# Altium project ELRS-RX-MODULE-V11-20260127.PrjPcb
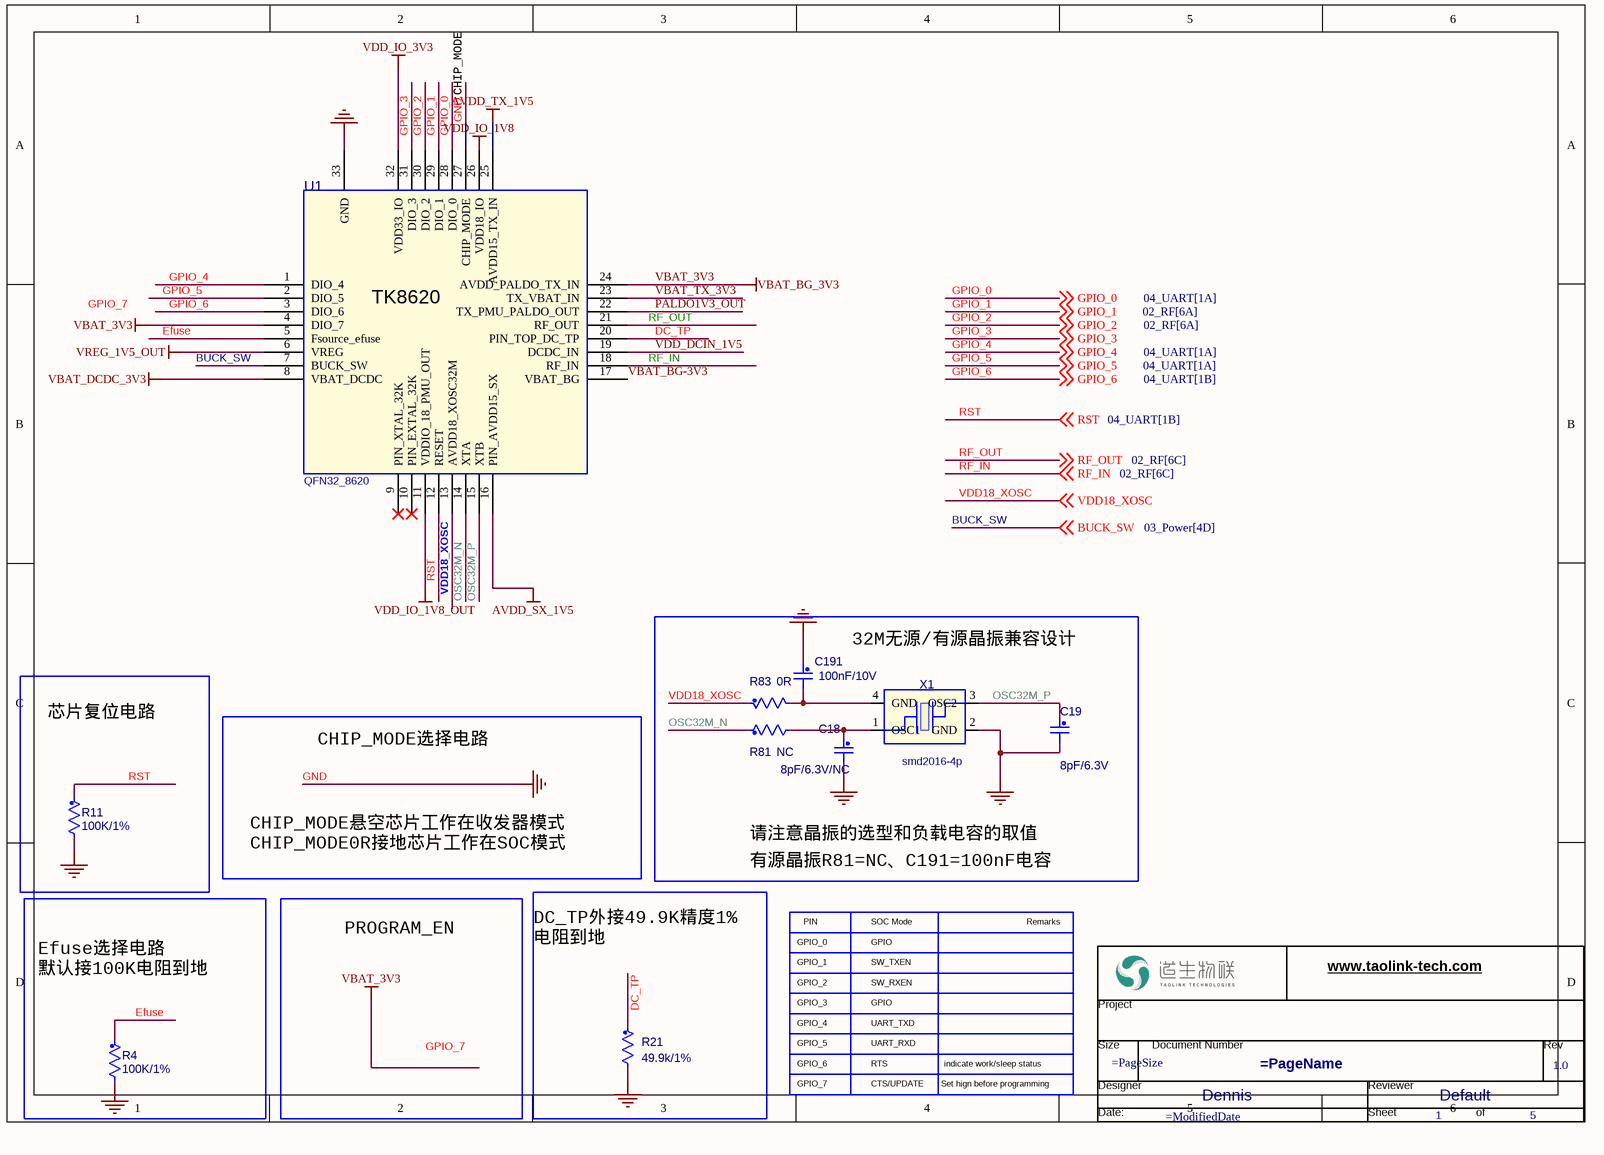
[diagram p0: 01_SOC.SchDoc]
5 sheets, 80 parts. Net scope: global (net labels, ports and power ports of the same name join across sheets).
Board file: ELRS-RX-MODULE-V11-20260204.PcbDoc
Sheets:
  01_SOC.SchDoc
  02_RF.SchDoc
  03_Power.SchDoc
  04_UART.SchDoc
  05_Notes.SchDoc

## Sheet 01_SOC.SchDoc
size 297 x 209 mm; SheetNumber: 1; SheetTotal: 5; Page Create Date: March  8, 1995; Page Number: 1; Page Size: A4; Reviewer: Default; Page Count: 5; Designer: Dennis; Page Name: 01_SOC; RevCode: 1.0; DsnPath: H:\PCB\2026\狼王傻波一\20260204_V0_ELRS-RX\ELRS-RX-MODULE-V11\ELRS-RX-MODULE-V11-20260127.DSN; SchematicName: SCHEMATIC1; PageName: 01_SOC; PageSize: A4; TopSchematic: True

### Parts
(Parts that share a designator on the sheet are numbered #1, #2 ... from top to bottom, then left to right.)
*#1  RevCode: 1.0  Designer: Dennis  Reviewer: Default  Page Number: 1  Page Count: 5  (graphical)
C18  8pF/6.3V/NC  [0201]
C19  8pF/6.3V  [0201]
C191  100nF/10V  [0201]
R4  100K/1%  [0201]
R11  100K/1%  [0201]
R21  49.9k/1%  [0201]
R81  NC  [0201]
R83  0R  [0201]
U1  TK8620  [QFN32_8620]
X1  X1E0002510059  [smd2016-4p]  (value not drawn)

### Blocks framed on the sheet
芯片复位电路: R11

### Nets
AVDD_SX_1V5: U1.16(PIN_AVDD15_SX)
AVDD_TX_1V5: U1.25(AVDD15_TX_IN)
GND: C18.2 C19.2 C191.1 R4.2 R11.2 R21.2 U1.27(CHIP_MODE) U1.33(GND) X1.2(GND)
PALDO1V3_OUT: U1.22(TX_PMU_PALDO_OUT)
VBAT_3V3: U1.4(DIO_7) U1.8(VBAT_DCDC) U1.23(TX_VBAT_IN) U1.24(AVDD_PALDO_TX_IN) U1.32(VDD33_IO)  [also labelled VBAT_BG_3V3, VBAT_DCDC_3V3, VBAT_TX_3V3, VDD_IO_3V3]
VBAT_BG-3V3: U1.17(VBAT_BG)
VDD_DCIN_1V5: U1.19(DCDC_IN)
VDD_IO_1V8: U1.11(VDDIO_18_PMU_OUT) U1.26(VDD18_IO)  [also labelled VDD_IO_1V8_OUT]
VREG_1V5_OUT: U1.6(VREG)
BUCK_SW: U1.7(BUCK_SW) ; off-sheet BUCK_SW
DC_TP: R21.1 U1.20(PIN_TOP_DC_TP)
Efuse: R4.1 U1.5(Fsource_efuse)
GPIO_0: U1.28(DIO_0) ; off-sheet GPIO_0
GPIO_1: U1.29(DIO_1) ; off-sheet GPIO_1
GPIO_2: U1.30(DIO_2) ; off-sheet GPIO_2
GPIO_3: U1.31(DIO_3) ; off-sheet GPIO_3
GPIO_4: U1.1(DIO_4) ; off-sheet GPIO_4
GPIO_5: U1.2(DIO_5) ; off-sheet GPIO_5
GPIO_6: U1.3(DIO_6) ; off-sheet GPIO_6
OSC32M_N: R81.1 U1.14(XTA)
OSC32M_P: C19.1 U1.15(XTB) X1.3(OSC2)
RF_IN: U1.18(RF_IN) ; off-sheet RF_IN
RF_OUT: U1.21(RF_OUT) ; off-sheet RF_OUT
RST: R11.1 U1.12(RESET) ; off-sheet RST
VDD18_XOSC: R83.1 U1.13(AVDD18_XOSC32M) ; off-sheet VDD18_XOSC
NetC18_1: C18.1 R81.2 X1.1(OSC1)
NetC191_2: C191.2 R83.2 X1.4(GND)

Not connected (* = marked no-connect by the designer): U1 9(PIN_XTAL_32K)* 10(PIN_EXTAL_32K)*

### Notes on the sheet
- CHIP_MODE
- 32M无源/有源晶振兼容设计
- CHIP_MODE选择电路
- CHIP_MODE悬空芯片工作在收发器模式
  CHIP_MODE0R接地芯片工作在SOC模式
- 请注意晶振的选型和负载电容的取值
- 有源晶振R81=NC、C191=100nF电容
- PROGRAM_EN
- DC_TP外接49.9K精度1%
  电阻到地
- GPIO_0
- PIN
- SOC Mode
- GPIO
- (near *#1) Remarks
- Efuse选择电路
  默认接100K电阻到地
- GPIO_1
- GPIO_2
- GPIO_3
- SW_RXEN
- SW_TXEN
- GPIO_4
- GPIO_5
- GPIO_6
- RTS
- UART_TXD
- UART_RXD
- indicate work/sleep status
- GPIO_7
- CTS/UPDATE
- Set hign before programming
- Labels drawn without touching a wire or pin: GPIO_7
- (in symbol TaoLin_DesignName) www.taolink-tech.com; Project; Size; Document Number; Rev; Designer; Reviewer; Date:; Sheet; of

### Library data of the parts
*#1 = TaoLin_DesignName: Page Create Date: March  8, 1995; Page Size: =PageSize; Page Name: =PageName; Page Modify Date: =ModifiedDate
C18 = Ceramic Capacitor: Ceramic Capacitor,22uF,6.3V,+/-20%,X5R,0603,Samsung; Part Reference: C18; Manufacturer P/N: CL10A226MQ8NRNC; Myir P/N: 20401.00086; Value: 8pF/6.3V/NC; PCB Footprint: 0201; Datasheet: Samsung.pdf; Reserve Value: 22uF; Manufacturer: Samsung; Part Type: Ceramic Capacitor
C19 = Ceramic Capacitor: Ceramic Capacitor,22uF,6.3V,+/-20%,X5R,0603,Samsung; Part Reference: C19; Manufacturer P/N: CL10A226MQ8NRNC; Myir P/N: 20401.00086; Value: 8pF/6.3V; PCB Footprint: 0201; Part Type: Ceramic Capacitor; Manufacturer: Samsung; Reserve Value: 22uF; Datasheet: Samsung.pdf
C191 = Ceramic Capacitor: Ceramic Capacitor,22uF,6.3V,+/-20%,X5R,0603,Samsung; Part Reference: C191; Manufacturer P/N: CL10A226MQ8NRNC; Myir P/N: 20401.00086; Value: 100nF/10V; PCB Footprint: 0201; Datasheet: Samsung.pdf; Reserve Value: 22uF; Manufacturer: Samsung; Part Type: Ceramic Capacitor
R4 = Resister: Thick Film Resistor,0R,+/-5%,1/16W,-55°C ~ 155°C,SMD,0402,Fenghua; Part Reference: R4; Manufacturer P/N: RC-02000JT; Myir P/N: 20301.00186; Value: 100K/1%; PCB Footprint: 0201; Datasheet: FH规格书_2018-07-30.pdf; Reserve Value: 0R; Manufacturer: Fenghua; Part Type: Thick Film Resistor
R11 = Resister: Thick Film Resistor,0R,+/-5%,1/16W,-55°C ~ 155°C,SMD,0402,Fenghua; Part Reference: R11; Manufacturer P/N: RC-02000JT; Myir P/N: 20301.00186; Value: 100K/1%; PCB Footprint: 0201; Datasheet: FH规格书_2018-07-30.pdf; Reserve Value: 0R; Manufacturer: Fenghua; Part Type: Thick Film Resistor
R21 = Resister: Thick Film Resistor,0R,+/-5%,1/16W,-55°C ~ 155°C,SMD,0402,Fenghua; Part Reference: R21; Manufacturer P/N: RC-02000JT; Myir P/N: 20301.00186; Value: 49.9k/1%; PCB Footprint: 0201; Part Type: Thick Film Resistor; Manufacturer: Fenghua; Reserve Value: 0R; Datasheet: FH规格书_2018-07-30.pdf
R81 = Resister: Thick Film Resistor,0R,+/-5%,1/16W,-55°C ~ 155°C,SMD,0402,Fenghua; Part Reference: R81; Manufacturer P/N: RC-02000JT; Myir P/N: 20301.00186; Value: NC; PCB Footprint: 0201; Part Type: Thick Film Resistor; Manufacturer: Fenghua; Reserve Value: 0R; Datasheet: FH规格书_2018-07-30.pdf
R83 = Resister: Thick Film Resistor,0R,+/-5%,1/16W,-55°C ~ 155°C,SMD,0402,Fenghua; Part Reference: R83; Manufacturer P/N: RC-02000JT; Myir P/N: 20301.00186; Value: 0R; PCB Footprint: 0201; Part Type: Thick Film Resistor; Manufacturer: Fenghua; Reserve Value: 0R; Datasheet: FH规格书_2018-07-30.pdf
U1 = K2201A_3: Part Reference: U1; Value: TK8620; PCB Footprint: QFN32_8620
X1 = Crystal_32M: Part Reference: X1; Value: X1E0002510059; PCB Footprint: smd2016-4p

## Sheet 02_RF.SchDoc
size 297 x 209 mm; Page Create Date: March  8, 1995; Page Number: 2; Page Size: A4; Reviewer: Default; Page Count: 5; Designer: Dennis; Page Name: 02_RF; RevCode: 1.0; DsnPath: H:\PCB\2026\狼王傻波一\20260204_V0_ELRS-RX\ELRS-RX-MODULE-V11\ELRS-RX-MODULE-V11-20260127.DSN; SchematicName: SCHEMATIC1; PageName: 02_RF; PageSize: A4; TopSchematic: True
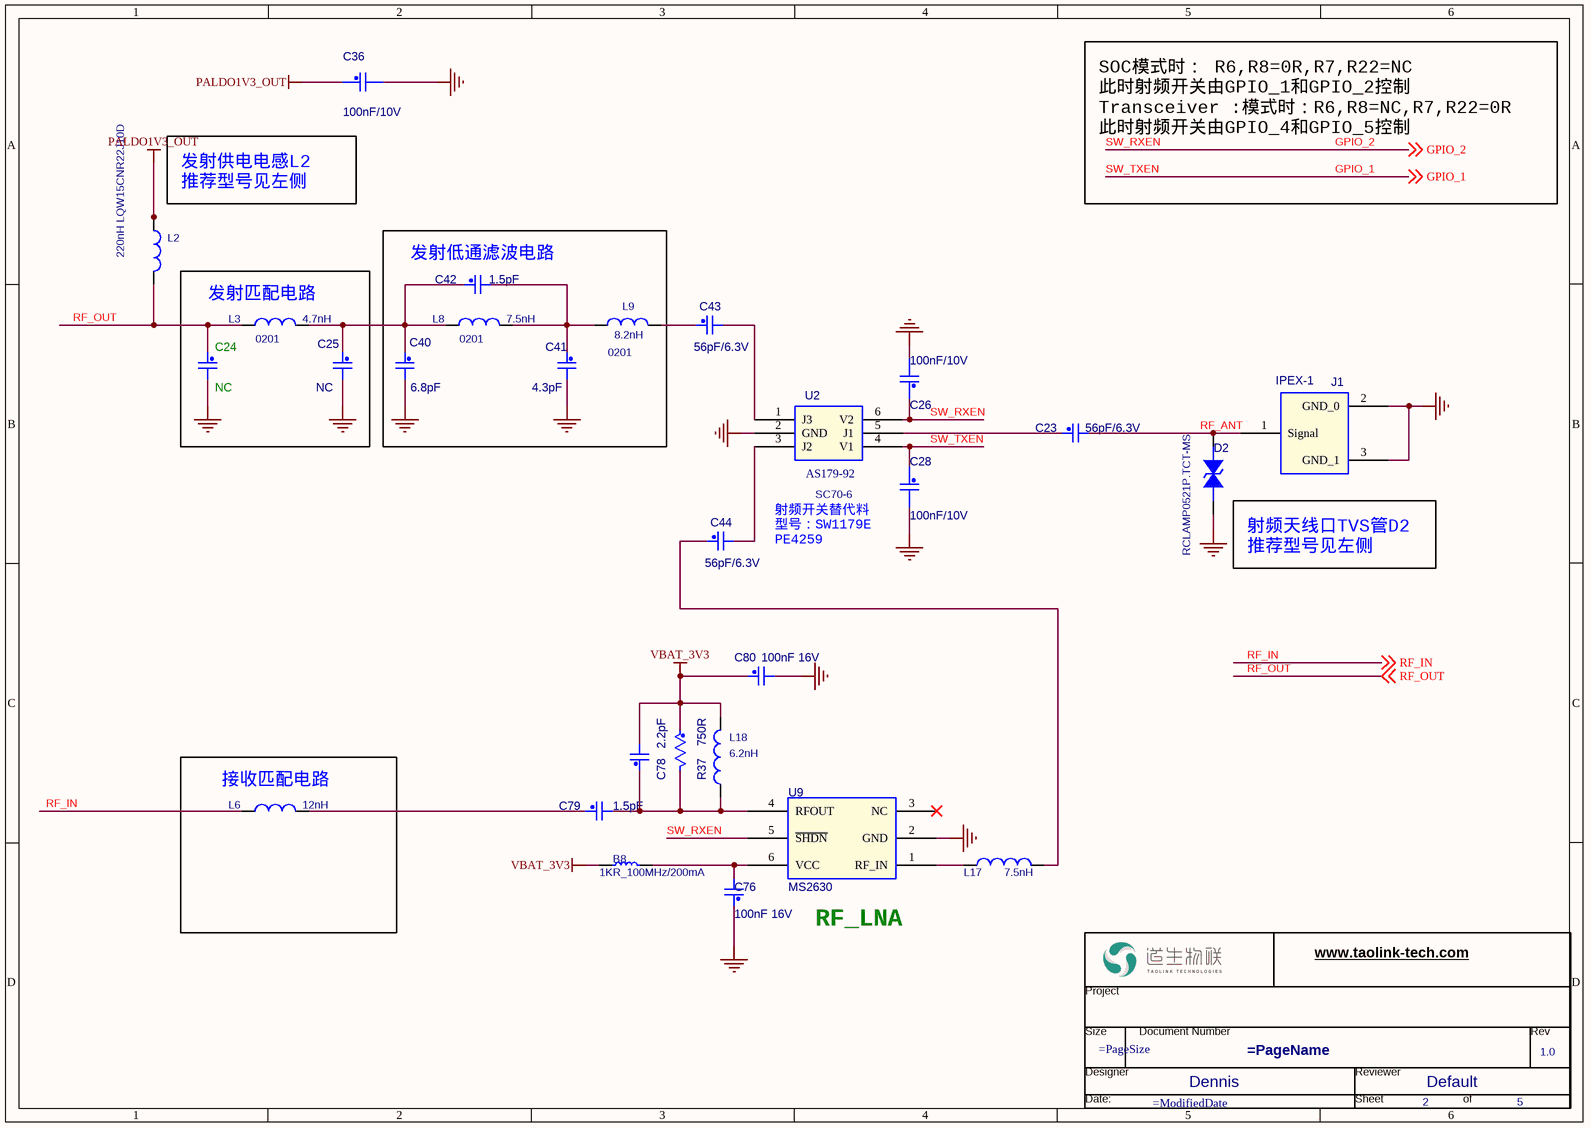
[diagram p1: 02_RF.SchDoc]

### Parts
(Parts that share a designator on the sheet are numbered #1, #2 ... from top to bottom, then left to right.)
*#2  RevCode: 1.0  Designer: Dennis  Reviewer: Default  Page Number: 2  Page Count: 5  (graphical)
B8  1KR_100MHz/200mA  [0201]
C23  56pF/6.3V  [0201]
C24  NC  [0201]
C25  NC  [0201]
C26  100nF/10V  [0201]
C28  100nF/10V  [0201]
C36  100nF/10V  [0201]
C40  6.8pF  [0201]
C41  4.3pF  [0201]
C42  1.5pF  [0201]
C43  56pF/6.3V  [0201]
C44  56pF/6.3V  [0201]
C76  100nF 16V  [0201]
C78  2.2pF  [0201]
C79  1.5pF  [0201]
C80  100nF 16V  [0201]
D2  RCLAMP0521P.TCT-MS  [TVS-0402]
J1  IPEX-1  [IPEX-1]
L2  220nH LQW15CNR22J10D  [L0402]
L3  4.7nH  [0201]
L6  12nH  [0201]
L8  7.5nH  [0201]
L9  8.2nH  [0201]
L17  7.5nH  [0201]
L18  6.2nH  [0201]
R37  750R  [0201]
U2  AS179-92  [SC70-6]
U9  MS2630  [SOT23-6]

### Blocks framed on the sheet
发射匹配电路: C24 C25 L3
发射低通滤波电路: C40-C42 L8 L9
接收匹配电路: L6

### Nets
GND: C24.2 C25.2 C26.2 C28.2 C36.2 C40.2 C41.2 C76.1 C80.2 D2.2(CATHODE) J1.2(GND_0) J1.3(GND_1) U2.2(GND) U9.2(GND)
PALDO1V3_OUT: C36.1 L2.1
VBAT_3V3: B8.2 C78.2 C80.1 L18.2 R37.1
GPIO_1: C28.1 U2.4(V1) ; off-sheet GPIO_1  [also labelled SW_TXEN]
GPIO_2: C26.1 U2.6(V2) U9.5(~{SHDN}) ; off-sheet GPIO_2  [also labelled SW_RXEN]
RF_ANT: C23.2 D2.1(ANODE) J1.1(Signal)
RF_IN: L6.1 ; off-sheet RF_IN
RF_OUT: C24.1 L2.2 L3.1 ; off-sheet RF_OUT
NetB8_1: B8.1 C76.2 U9.6(VCC)
NetC23_1: C23.1 U2.5(J1)
NetC25_1: C25.1 C40.1 C42.1 L3.2 L8.1
NetC41_1: C41.1 C42.2 L8.2 L9.1
NetC43_1: C43.1 L9.2
NetC43_2: C43.2 U2.1(J3)
NetC44_1: C44.1 L17.2
NetC44_2: C44.2 U2.3(J2)
NetC78_1: C78.1 C79.2 L18.1 R37.2 U9.4(RFOUT)
NetC79_1: C79.1 L6.2
NetL17_1: L17.1 U9.1(RF_IN)

Not connected (* = marked no-connect by the designer): U9 3(NC)*

### Notes on the sheet
- SOC模式时： R6,R8=0R,R7,R22=NC
  此时射频开关由GPIO_1和GPIO_2控制
  Transceiver :模式时：R6,R8=NC,R7,R22=0R
  此时射频开关由GPIO_4和GPIO_5控制
- 发射供电电感L2
  推荐型号见左侧
- (near C28) 射频开关替代料
  型号：SW1179E
  PE4259
- 射频天线口TVS管D2
  推荐型号见左侧
- (near U9) RF_LNA
- (in symbol TaoLin_DesignName) www.taolink-tech.com; Project; Size; Document Number; Rev; Designer; Reviewer; Date:; Sheet; of

### Library data of the parts
*#2 = TaoLin_DesignName: Page Create Date: March  8, 1995; Page Size: =PageSize; Page Name: =PageName; Page Modify Date: =ModifiedDate
B8 = INDUCTOR_Dup1: Part Reference: B8; Reviewed2: LBY; FPLIST: 0402R_S,0402R,0402R_M,0402R_MIN,R0402; 存货简称: TURBO; 型号: 1.5K 1%; 规格: 贴装碳膜电阻器－1.5KR－±1%－1/16W－0402; 存货名称: 贴片电阻; 存货编码: 040101070; Value: 1KR_100MHz/200mA; PCB Footprint: 0201
C23 = Ceramic Capacitor: Ceramic Capacitor,22uF,6.3V,+/-20%,X5R,0603,Samsung; Part Reference: C23; Manufacturer P/N: CL10A226MQ8NRNC; Myir P/N: 20401.00086; Value: 56pF/6.3V; PCB Footprint: 0201; Part Type: Ceramic Capacitor; Manufacturer: Samsung; Reserve Value: 22uF; Datasheet: Samsung.pdf
C24 = Ceramic Capacitor: Ceramic Capacitor,22uF,6.3V,+/-20%,X5R,0603,Samsung; Part Reference: C24; Manufacturer P/N: CL10A226MQ8NRNC; Myir P/N: 20401.00086; Value: NC; PCB Footprint: 0201; Part Type: Ceramic Capacitor; Manufacturer: Samsung; Reserve Value: 22uF; Datasheet: Samsung.pdf
C25 = Ceramic Capacitor: Ceramic Capacitor,22uF,6.3V,+/-20%,X5R,0603,Samsung; Part Reference: C25; Manufacturer P/N: CL10A226MQ8NRNC; Myir P/N: 20401.00086; Value: NC; PCB Footprint: 0201; Part Type: Ceramic Capacitor; Manufacturer: Samsung; Reserve Value: 22uF; Datasheet: Samsung.pdf
C26 = Ceramic Capacitor_14: Ceramic Capacitor,100nF,50V,+/-10%,X7R,0402,Fenghua; Part Reference: C26; Manufacturer P/N: 0402B104K500NT; Myir P/N: 2040180111; Value: 100nF/10V; PCB Footprint: 0201; Part Type: Ceramic Capacitor; Manufacturer: Fenghua; Reserve Value: 100nF; Datasheet: 附件7 风华片容全系列承认书.pdf
C28 = Ceramic Capacitor_14: Ceramic Capacitor,100nF,50V,+/-10%,X7R,0402,Fenghua; Part Reference: C28; Manufacturer P/N: 0402B104K500NT; Myir P/N: 2040180111; Value: 100nF/10V; PCB Footprint: 0201; Datasheet: 附件7 风华片容全系列承认书.pdf; Reserve Value: 100nF; Manufacturer: Fenghua; Part Type: Ceramic Capacitor
C36 = Ceramic Capacitor_14: Ceramic Capacitor,100nF,50V,+/-10%,X7R,0402,Fenghua; Part Reference: C36; Manufacturer P/N: 0402B104K500NT; Myir P/N: 2040180111; Value: 100nF/10V; PCB Footprint: 0201; Part Type: Ceramic Capacitor; Manufacturer: Fenghua; Reserve Value: 100nF; Datasheet: 附件7 风华片容全系列承认书.pdf
C40 = Ceramic Capacitor: Ceramic Capacitor,22uF,6.3V,+/-20%,X5R,0603,Samsung; Part Reference: C40; Manufacturer P/N: CL10A226MQ8NRNC; Myir P/N: 20401.00086; Value: 6.8pF; PCB Footprint: 0201; Datasheet: Samsung.pdf; Reserve Value: 22uF; Manufacturer: Samsung; Part Type: Ceramic Capacitor
C41 = Ceramic Capacitor: Ceramic Capacitor,22uF,6.3V,+/-20%,X5R,0603,Samsung; Part Reference: C41; Manufacturer P/N: CL10A226MQ8NRNC; Myir P/N: 20401.00086; Value: 4.3pF; PCB Footprint: 0201; Datasheet: Samsung.pdf; Reserve Value: 22uF; Manufacturer: Samsung; Part Type: Ceramic Capacitor
C42 = Ceramic Capacitor: Ceramic Capacitor,22uF,6.3V,+/-20%,X5R,0603,Samsung; Part Reference: C42; Manufacturer P/N: CL10A226MQ8NRNC; Myir P/N: 20401.00086; Value: 1.5pF; PCB Footprint: 0201; Part Type: Ceramic Capacitor; Manufacturer: Samsung; Reserve Value: 22uF; Datasheet: Samsung.pdf
C43 = Ceramic Capacitor: Ceramic Capacitor,22uF,6.3V,+/-20%,X5R,0603,Samsung; Part Reference: C43; Manufacturer P/N: CL10A226MQ8NRNC; Myir P/N: 20401.00086; Value: 56pF/6.3V; PCB Footprint: 0201; Datasheet: Samsung.pdf; Reserve Value: 22uF; Manufacturer: Samsung; Part Type: Ceramic Capacitor
C44 = Ceramic Capacitor: Ceramic Capacitor,22uF,6.3V,+/-20%,X5R,0603,Samsung; Part Reference: C44; Manufacturer P/N: CL10A226MQ8NRNC; Myir P/N: 20401.00086; Value: 56pF/6.3V; PCB Footprint: 0201; Part Type: Ceramic Capacitor; Manufacturer: Samsung; Reserve Value: 22uF; Datasheet: Samsung.pdf
C76 = Ceramic Capacitor: Ceramic Capacitor,22uF,6.3V,+/-20%,X5R,0603,Samsung; Part Reference: C76; Manufacturer P/N: CL10A226MQ8NRNC; Myir P/N: 20401.00086; Value: 100nF 16V; Datasheet: Samsung.pdf; Reserve Value: 22uF; Manufacturer: Samsung; Part Type: Ceramic Capacitor; PCB Footprint: 0201
C78 = Ceramic Capacitor: Ceramic Capacitor,22uF,6.3V,+/-20%,X5R,0603,Samsung; Part Reference: C78; Manufacturer P/N: CL10A226MQ8NRNC; Myir P/N: 20401.00086; Value: 2.2pF; PCB Footprint: 0201; Part Type: Ceramic Capacitor; Manufacturer: Samsung; Reserve Value: 22uF; Datasheet: Samsung.pdf
C79 = Ceramic Capacitor: Ceramic Capacitor,22uF,6.3V,+/-20%,X5R,0603,Samsung; Part Reference: C79; Manufacturer P/N: CL10A226MQ8NRNC; Myir P/N: 20401.00086; Value: 1.5pF; PCB Footprint: 0201; Part Type: Ceramic Capacitor; Manufacturer: Samsung; Reserve Value: 22uF; Datasheet: Samsung.pdf
C80 = Ceramic Capacitor: Ceramic Capacitor,22uF,6.3V,+/-20%,X5R,0603,Samsung; Part Reference: C80; Manufacturer P/N: CL10A226MQ8NRNC; Myir P/N: 20401.00086; Value: 100nF 16V; PCB Footprint: 0201; Datasheet: Samsung.pdf; Reserve Value: 22uF; Manufacturer: Samsung; Part Type: Ceramic Capacitor
D2 = TVS: Part Reference: D2; Value: RCLAMP0521P.TCT-MS; PCB Footprint: TVS-0402
J1 = IPEX-1: Part Reference: J1; Value: IPEX-1; PCB Footprint: IPEX-1
L2 = INDUCTOR_Dup2: Part Reference: L2; Value: 220nH LQW15CNR22J10D; PCB Footprint: L0402
L3 = INDUCTOR_Dup2: Part Reference: L3; Value: 4.7nH; PCB Footprint: 0201
L6 = INDUCTOR_Dup2: Part Reference: L6; Value: 12nH; PCB Footprint: 0201
L8 = INDUCTOR_Dup2: Part Reference: L8; Value: 7.5nH; PCB Footprint: 0201
L9 = INDUCTOR_Dup2: Part Reference: L9; Value: 8.2nH; PCB Footprint: 0201
L17 = INDUCTOR: Part Reference: L17; Value: 7.5nH; PCB Footprint: 0201
L18 = INDUCTOR: Part Reference: L18; Value: 6.2nH; PCB Footprint: 0201
R37 = Resister: Thick Film Resistor,0R,+/-5%,1/16W,-55°C ~ 155°C,SMD,0402,Fenghua; Part Reference: R37; Manufacturer P/N: RC-02000JT; Myir P/N: 20301.00186; Value: 750R; PCB Footprint: 0201; Part Type: Thick Film Resistor; Manufacturer: Fenghua; Reserve Value: 0R; Datasheet: FH规格书_2018-07-30.pdf
U2 = AS179-92: Part Reference: U2; Value: AS179-92; PCB Footprint: SC70-6
U9 = MS2630: Part Reference: U9; Value: MS2630; PCB Footprint: SOT23-6

## Sheet 03_Power.SchDoc
size 297 x 209 mm; SheetNumber: 3; SheetTotal: 5; Page Create Date: March  8, 1995; Page Number: 3; Page Size: A4; Reviewer: Default; Page Count: 5; Designer: Dennis; Page Name: 03_Power; RevCode: 1.0; DsnPath: H:\PCB\2026\狼王傻波一\20260204_V0_ELRS-RX\ELRS-RX-MODULE-V11\ELRS-RX-MODULE-V11-20260127.DSN; SchematicName: SCHEMATIC1; PageName: 03_Power; PageSize: A4; TopSchematic: True
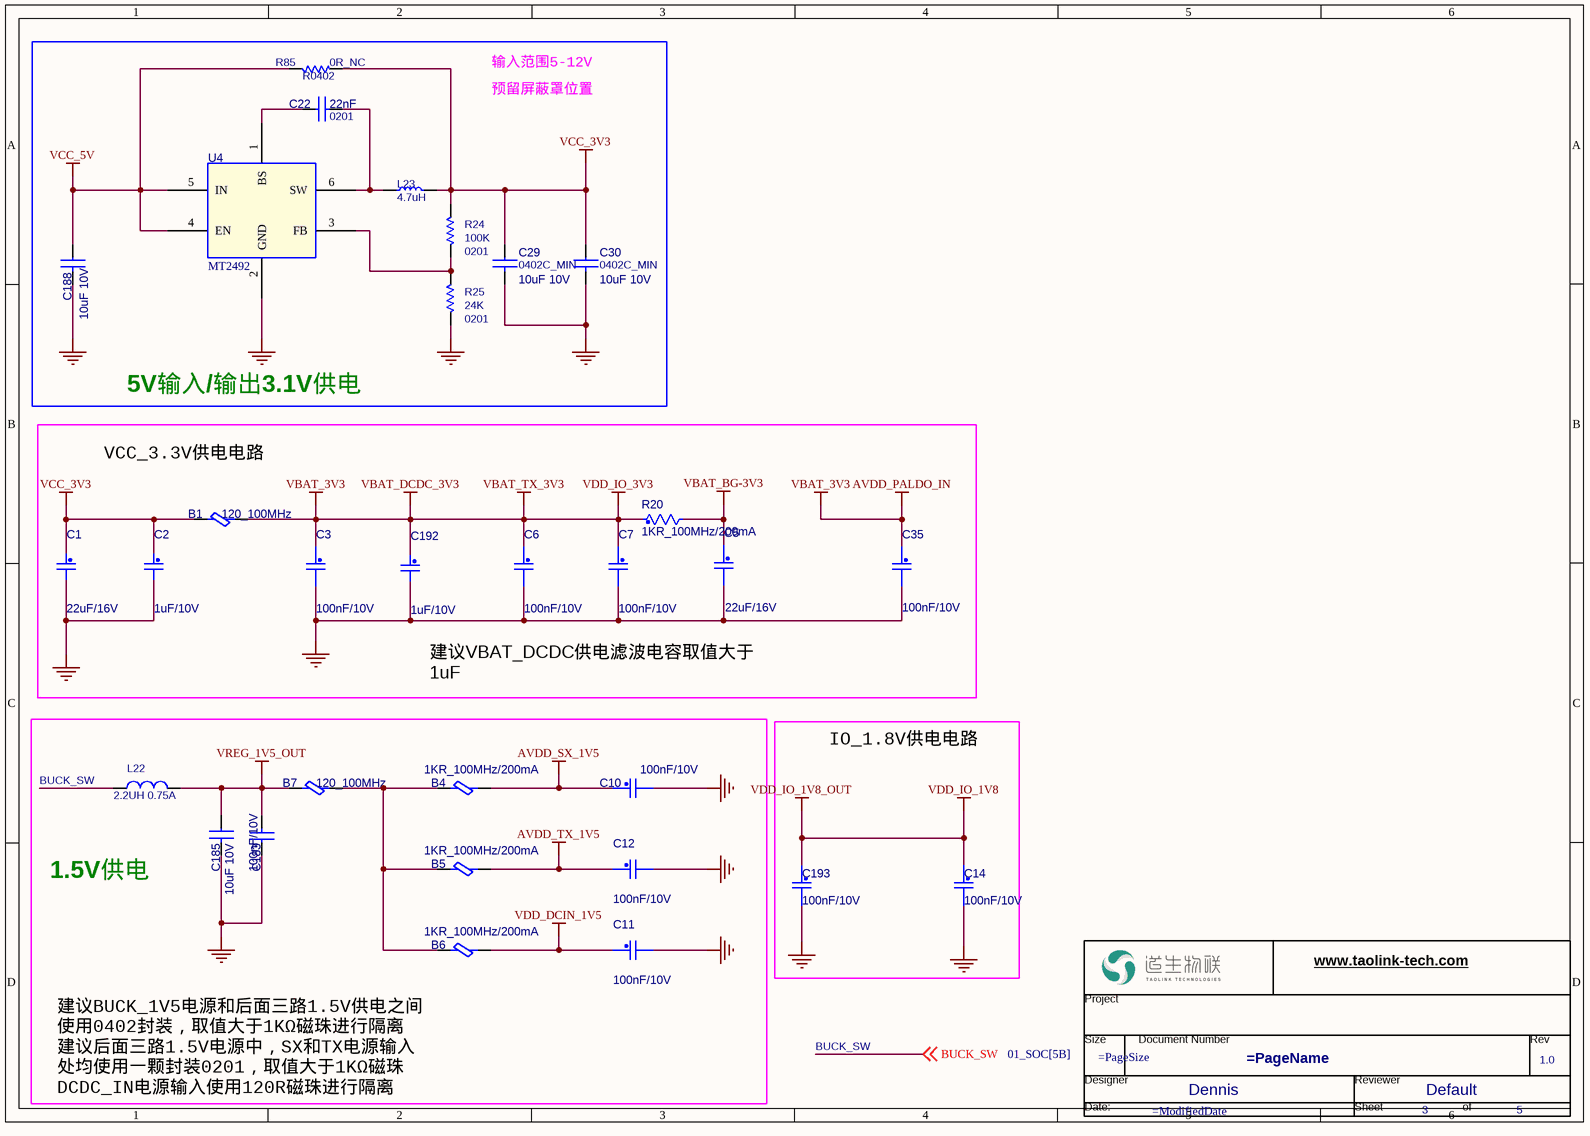
[diagram p2: 03_Power.SchDoc]

### Parts
(Parts that share a designator on the sheet are numbered #1, #2 ... from top to bottom, then left to right.)
*#3  RevCode: 1.0  Designer: Dennis  Reviewer: Default  Page Number: 3  Page Count: 5  (graphical)
B1  120_100MHz  [l0402]
B4  1KR_100MHz/200mA  [0201]
B5  1KR_100MHz/200mA  [0201]
B6  1KR_100MHz/200mA  [0201]
B7  120_100MHz  [l0402]
C1  22uF/16V  [C0402]
C2  1uF/10V  [0201]
C3  100nF/10V  [0201]
C5  22uF/16V  [C0402]
C6  100nF/10V  [0201]
C7  100nF/10V  [0201]
C10  100nF/10V  [0201]
C11  100nF/10V  [0201]
C12  100nF/10V  [0201]
C14  100nF/10V  [0201]
C22  22nF  [0201]
C29  10uF 10V  [0402C_MIN]
C30  10uF 10V  [0402C_MIN]
C35  100nF/10V  [0201]
C183  100nF/10V  [0201]
C185  10uF 10V  [0402C_MIN]
C188  10uF 10V  [0402C_MIN]
C192  1uF/10V  [0201]
C193  100nF/10V  [0201]
L22  2.2UH 0.75A  [C0603]
L23  4.7uH  [R0603]
R20  1KR_100MHz/200mA  [0201]
R24  100K  [0201]
R25  24K  [0201]
R85  0R_NC  [R0402]
U4  MT2492  [SOT23-6]

### Blocks framed on the sheet
5V输入/输出3.1V供电: C22 C29 C30 C188 L23 R24 R25 R85 U4
VCC_3.3V供电电路: B1 C1-C3 C5-C7 C35 C192 R20
1.5V供电: B4-B7 C10-C12 C183 C185 L22
IO_1.8V供电电路: C14 C193

### Nets
AVDD_SX_1V5: B4.2 C10.1
AVDD_TX_1V5: B5.2 C12.1
GND: C1.2 C2.2 C3.2 C5.2 C6.2 C7.2 C10.2 C11.2 C12.2 C14.2 C29.2 C30.2 C35.2 C183.1 C185.2 C188.2 C192.2 C193.2 R25.2 U4.2(GND)
VBAT_3V3: B1.2 C3.1 C6.1 C7.1 C35.1 C192.1 R20.1  [also labelled AVDD_PALDO_IN, VBAT_DCDC_3V3, VBAT_TX_3V3, VDD_IO_3V3]
VBAT_BG-3V3: C5.1 R20.2
VCC_3V3: B1.1 C1.1 C2.1 C29.1 C30.1 L23.2 R24.1 R85.2
VCC_5V: C188.1 R85.1 U4.4(EN) U4.5(IN)
VDD_DCIN_1V5: B6.2 C11.1
VDD_IO_1V8: C14.1 C193.1  [also labelled VDD_IO_1V8_OUT]
VREG_1V5_OUT: B7.1 C183.2 C185.1 L22.2
BUCK_SW: L22.1 ; off-sheet BUCK_SW
NetB4_1: B4.1 B5.1 B6.1 B7.2
NetC22_1: C22.1 U4.1(BS)
NetC22_2: C22.2 L23.1 U4.6(SW)
NetR24_2: R24.2 R25.1 U4.3(FB)

### Notes on the sheet
- 输入范围5-12V
- 预留屏蔽罩位置
- 建议VBAT_DCDC供电滤波电容取值大于1uF
  建议VBAT_BG供电滤波电容取值大于10uF
- (near B6) 建议BUCK_1V5电源和后面三路1.5V供电之间
  使用0402封装，取值大于1KΩ磁珠进行隔离
  建议后面三路1.5V电源中，SX和TX电源输入
  处均使用一颗封装0201，取值大于1KΩ磁珠
  DCDC_IN电源输入使用120R磁珠进行隔离
- (in symbol TaoLin_DesignName) www.taolink-tech.com; Project; Size; Document Number; Rev; Designer; Reviewer; Date:; Sheet; of

### Library data of the parts
*#3 = TaoLin_DesignName: Page Create Date: March  8, 1995; Page Size: =PageSize; Page Name: =PageName; Page Modify Date: =ModifiedDate
B1 = 1212_BEAD_0: FERRITE CHIP 120 OHM 500MA 0402; Part Reference: B1; eI Part#: 04_00075_01; Vendor Part#: 490-1005-1-ND; Mfg Part#: BLM15AG121SN1D; CLASS: DISCRETE; Mfg: Murata; Vendor: DigiKey; Oper. Temp. Range: -55C to 85C; Tolerance: 25%; ProcessType: SMT; Value: 120_100MHz; PCB Footprint: l0402; RoHS: Yes; Package: L0201; Manufacture Part Number: BLM15AG121SN1D
B4 = 1212_BEAD_0: FERRITE CHIP 120 OHM 500MA 0402; Part Reference: B4; Manufacture Part Number: BLM15AG121SN1D; Vendor Part#: 490-1005-1-ND; eI Part#: 04_00075_01; CLASS: DISCRETE; ProcessType: SMT; Tolerance: 25%; Oper. Temp. Range: -55C to 85C; Vendor: DigiKey; Mfg: Murata; Value: 1KR_100MHz/200mA; PCB Footprint: 0201; Package: 0402; Mfg Part#: BLM15AG121SN1D; RoHS: Yes
B5 = 1212_BEAD_0: FERRITE CHIP 120 OHM 500MA 0402; Part Reference: B5; Manufacture Part Number: BLM15AG121SN1D; Vendor Part#: 490-1005-1-ND; eI Part#: 04_00075_01; CLASS: DISCRETE; ProcessType: SMT; Tolerance: 25%; Oper. Temp. Range: -55C to 85C; Vendor: DigiKey; Mfg: Murata; Value: 1KR_100MHz/200mA; PCB Footprint: 0201; Package: 0402; Mfg Part#: BLM15AG121SN1D; RoHS: Yes
B6 = 1212_BEAD_0: FERRITE CHIP 120 OHM 500MA 0402; Part Reference: B6; Manufacture Part Number: BLM15AG121SN1D; Vendor Part#: 490-1005-1-ND; eI Part#: 04_00075_01; CLASS: DISCRETE; ProcessType: SMT; Tolerance: 25%; Oper. Temp. Range: -55C to 85C; Vendor: DigiKey; Mfg: Murata; Value: 1KR_100MHz/200mA; PCB Footprint: 0201; Package: 0402; Mfg Part#: BLM15AG121SN1D; RoHS: Yes
B7 = 1212_BEAD_0: FERRITE CHIP 120 OHM 500MA 0402; Part Reference: B7; Manufacture Part Number: BLM15AG121SN1D; Vendor Part#: 490-1005-1-ND; eI Part#: 04_00075_01; CLASS: DISCRETE; ProcessType: SMT; Tolerance: 25%; Oper. Temp. Range: -55C to 85C; Vendor: DigiKey; Mfg: Murata; Value: 120_100MHz; PCB Footprint: l0402; Package: 0402; Mfg Part#: BLM15AG121SN1D; RoHS: Yes
C1 = Ceramic Capacitor: Ceramic Capacitor, 10uF,+/-20%,X6S,16V,SMD,0603; Part Reference: C1; Manufacturer P/N: GRM188C81C106MA73D; Manufacturer: Murata; Myir P/N: 2040100037; Value: 22uF/16V; PCB Footprint: C0402; Datasheet: Ceramic Capacitor.pdf; Reserve Value: 10uF; Part Type: Ceramic Capacitor
C2 = Ceramic Capacitor: Ceramic Capacitor,4.7uF 10V 0402,SUMSUNG; Part Reference: C2; Manufacturer P/N: CL05A475MP5NRNC; Manufacturer: Samsung; Myir P/N: 2040180055; Value: 1uF/10V; PCB Footprint: 0201; Datasheet: CL05A475MP5NRNC.pdf; Reserve Value: 4.7uF; Part Type: Ceramic Capacitor
C3 = Ceramic Capacitor_14: Ceramic Capacitor,100nF,50V,+/-10%,X7R,0402,Fenghua; Part Reference: C3; Manufacturer P/N: 0402B104K500NT; Myir P/N: 2040180111; Value: 100nF/10V; PCB Footprint: 0201; Datasheet: 附件7 风华片容全系列承认书.pdf; Reserve Value: 100nF; Manufacturer: Fenghua; Part Type: Ceramic Capacitor
C5 = Ceramic Capacitor_14: Ceramic Capacitor,100nF,50V,+/-10%,X7R,0402,Fenghua; Part Reference: C5; Manufacturer P/N: 0402B104K500NT; Myir P/N: 2040180111; Value: 22uF/16V; PCB Footprint: C0402; Part Type: Ceramic Capacitor; Manufacturer: Fenghua; Reserve Value: 100nF; Datasheet: 附件7 风华片容全系列承认书.pdf
C6 = Ceramic Capacitor_14: Ceramic Capacitor,100nF,50V,+/-10%,X7R,0402,Fenghua; Part Reference: C6; Manufacturer P/N: 0402B104K500NT; Myir P/N: 2040180111; Value: 100nF/10V; PCB Footprint: 0201; Datasheet: 附件7 风华片容全系列承认书.pdf; Reserve Value: 100nF; Manufacturer: Fenghua; Part Type: Ceramic Capacitor
C7 = Ceramic Capacitor_14: Ceramic Capacitor,100nF,50V,+/-10%,X7R,0402,Fenghua; Part Reference: C7; Manufacturer P/N: 0402B104K500NT; Myir P/N: 2040180111; Value: 100nF/10V; PCB Footprint: 0201; Datasheet: 附件7 风华片容全系列承认书.pdf; Reserve Value: 100nF; Manufacturer: Fenghua; Part Type: Ceramic Capacitor
C10 = Ceramic Capacitor_14: Ceramic Capacitor,100nF,50V,+/-10%,X7R,0402,Fenghua; Part Reference: C10; Manufacturer P/N: 0402B104K500NT; Myir P/N: 2040180111; Value: 100nF/10V; PCB Footprint: 0201; Datasheet: 附件7 风华片容全系列承认书.pdf; Reserve Value: 100nF; Manufacturer: Fenghua; Part Type: Ceramic Capacitor
C11 = Ceramic Capacitor_14: Ceramic Capacitor,100nF,50V,+/-10%,X7R,0402,Fenghua; Part Reference: C11; Manufacturer P/N: 0402B104K500NT; Myir P/N: 2040180111; Value: 100nF/10V; PCB Footprint: 0201; Datasheet: 附件7 风华片容全系列承认书.pdf; Reserve Value: 100nF; Manufacturer: Fenghua; Part Type: Ceramic Capacitor
C12 = Ceramic Capacitor_14: Ceramic Capacitor,100nF,50V,+/-10%,X7R,0402,Fenghua; Part Reference: C12; Manufacturer P/N: 0402B104K500NT; Myir P/N: 2040180111; Value: 100nF/10V; PCB Footprint: 0201; Part Type: Ceramic Capacitor; Manufacturer: Fenghua; Reserve Value: 100nF; Datasheet: 附件7 风华片容全系列承认书.pdf
C14 = Ceramic Capacitor_14: Ceramic Capacitor,100nF,50V,+/-10%,X7R,0402,Fenghua; Part Reference: C14; Manufacturer P/N: 0402B104K500NT; Myir P/N: 2040180111; Value: 100nF/10V; PCB Footprint: 0201; Part Type: Ceramic Capacitor; Manufacturer: Fenghua; Reserve Value: 100nF; Datasheet: 附件7 风华片容全系列承认书.pdf
C22 = CAPACITOR NON-POL: Part Reference: C22; Value: 22nF; PCB Footprint: 0201
C29 = CAPACITOR NON-POL: Part Reference: C29; Value: 10uF 10V; PCB Footprint: 0402C_MIN
C30 = CAPACITOR NON-POL: Part Reference: C30; Value: 10uF 10V; PCB Footprint: 0402C_MIN
C35 = Ceramic Capacitor_14: Ceramic Capacitor,100nF,50V,+/-10%,X7R,0402,Fenghua; Part Reference: C35; Manufacturer P/N: 0402B104K500NT; Myir P/N: 2040180111; Value: 100nF/10V; PCB Footprint: 0201; Part Type: Ceramic Capacitor; Manufacturer: Fenghua; Reserve Value: 100nF; Datasheet: 附件7 风华片容全系列承认书.pdf
C183 = CAP_NP: Part Reference: C183; 存货简称: TURBO; 型号: 100nF 16V; 规格: 贴片电容－0.1uF－±10%－16V－X7R－0402; 存货名称: 贴片电容; 存货编码: 040203017; FPLIST: 0402C_S,0402C,0402C_M,0402C_MIN,0402C-BGA,C0402; Value: 100nF/10V; PCB Footprint: 0201
C185 = CAP_NP: Part Reference: C185; 存货简称: TURBO; 型号: 10uF 6.3V; 规格: 贴片电容－10uF－±20%－6.3V－X5R－0402; 存货名称: 贴片电容; 存货编码: 040203157; FPLIST: 0402C_S,0402C,0402C_M,0402C_MIN,0402C-BGA,C0402; Value: 10uF 10V; PCB Footprint: 0402C_MIN
C188 = CAP_NP: Part Reference: C188; FPLIST: 0402C_S,0402C,0402C_M,0402C_MIN,0402C-BGA,C0402; 存货编码: 040203157; 存货名称: 贴片电容; 规格: 贴片电容－10uF－±20%－6.3V－X5R－0402; 型号: 10uF 6.3V; 存货简称: TURBO; Value: 10uF 10V; PCB Footprint: 0402C_MIN
C192 = Ceramic Capacitor: Ceramic Capacitor,4.7uF 10V 0402,SUMSUNG; Part Reference: C192; Manufacturer: Samsung; Manufacturer P/N: CL05A475MP5NRNC; Myir P/N: 2040180055; Value: 1uF/10V; PCB Footprint: 0201; Part Type: Ceramic Capacitor; Reserve Value: 4.7uF; Datasheet: CL05A475MP5NRNC.pdf
C193 = Ceramic Capacitor_14: Ceramic Capacitor,100nF,50V,+/-10%,X7R,0402,Fenghua; Part Reference: C193; Manufacturer P/N: 0402B104K500NT; Myir P/N: 2040180111; Value: 100nF/10V; PCB Footprint: 0201; Part Type: Ceramic Capacitor; Manufacturer: Fenghua; Reserve Value: 100nF; Datasheet: 附件7 风华片容全系列承认书.pdf
L22 = INDUCTOR_Dup2: Part Reference: L22; FPLIST: 0603L_S,0603L,0603L_M,0603L_MIN; Reviewed2: LBY; Value: 2.2UH 0.75A; PCB Footprint: C0603
L23 = INDUCTOR_Dup1: Part Reference: L23; Reviewed: LBY; Value: 4.7uH; PCB Footprint: R0603
R20 = Resister: Thick Film Resistor,0R,+/-5%,1/16W,-55°C ~ 155°C,SMD,0402,Fenghua; Part Reference: R20; Manufacturer P/N: RC-02000JT; Myir P/N: 20301.00186; Value: 1KR_100MHz/200mA; PCB Footprint: 0201; Part Type: Thick Film Resistor; Manufacturer: Fenghua; Reserve Value: 0R; Datasheet: FH规格书_2018-07-30.pdf
R24 = R: Part Reference: R24; Value: 100K; PCB Footprint: 0201
R25 = R: Part Reference: R25; Value: 24K; PCB Footprint: 0201
R85 = R: Part Reference: R85; Value: 0R_NC; PCB Footprint: R0402
U4 = MT2492: Part Reference: U4; Value: MT2492; PCB Footprint: SOT23-6

## Sheet 04_UART.SchDoc
size 297 x 209 mm; SheetNumber: 4; SheetTotal: 5; Page Create Date: March  8, 1995; Page Number: 4; Page Size: A4; Reviewer: Default; Page Count: 5; Designer: Dennis; Page Name: 04_UART; RevCode: 1.0; DsnPath: H:\PCB\2026\狼王傻波一\20260204_V0_ELRS-RX\ELRS-RX-MODULE-V11\ELRS-RX-MODULE-V11-20260127.DSN; SchematicName: SCHEMATIC1; PageName: 04_UART; PageSize: A4; TopSchematic: True
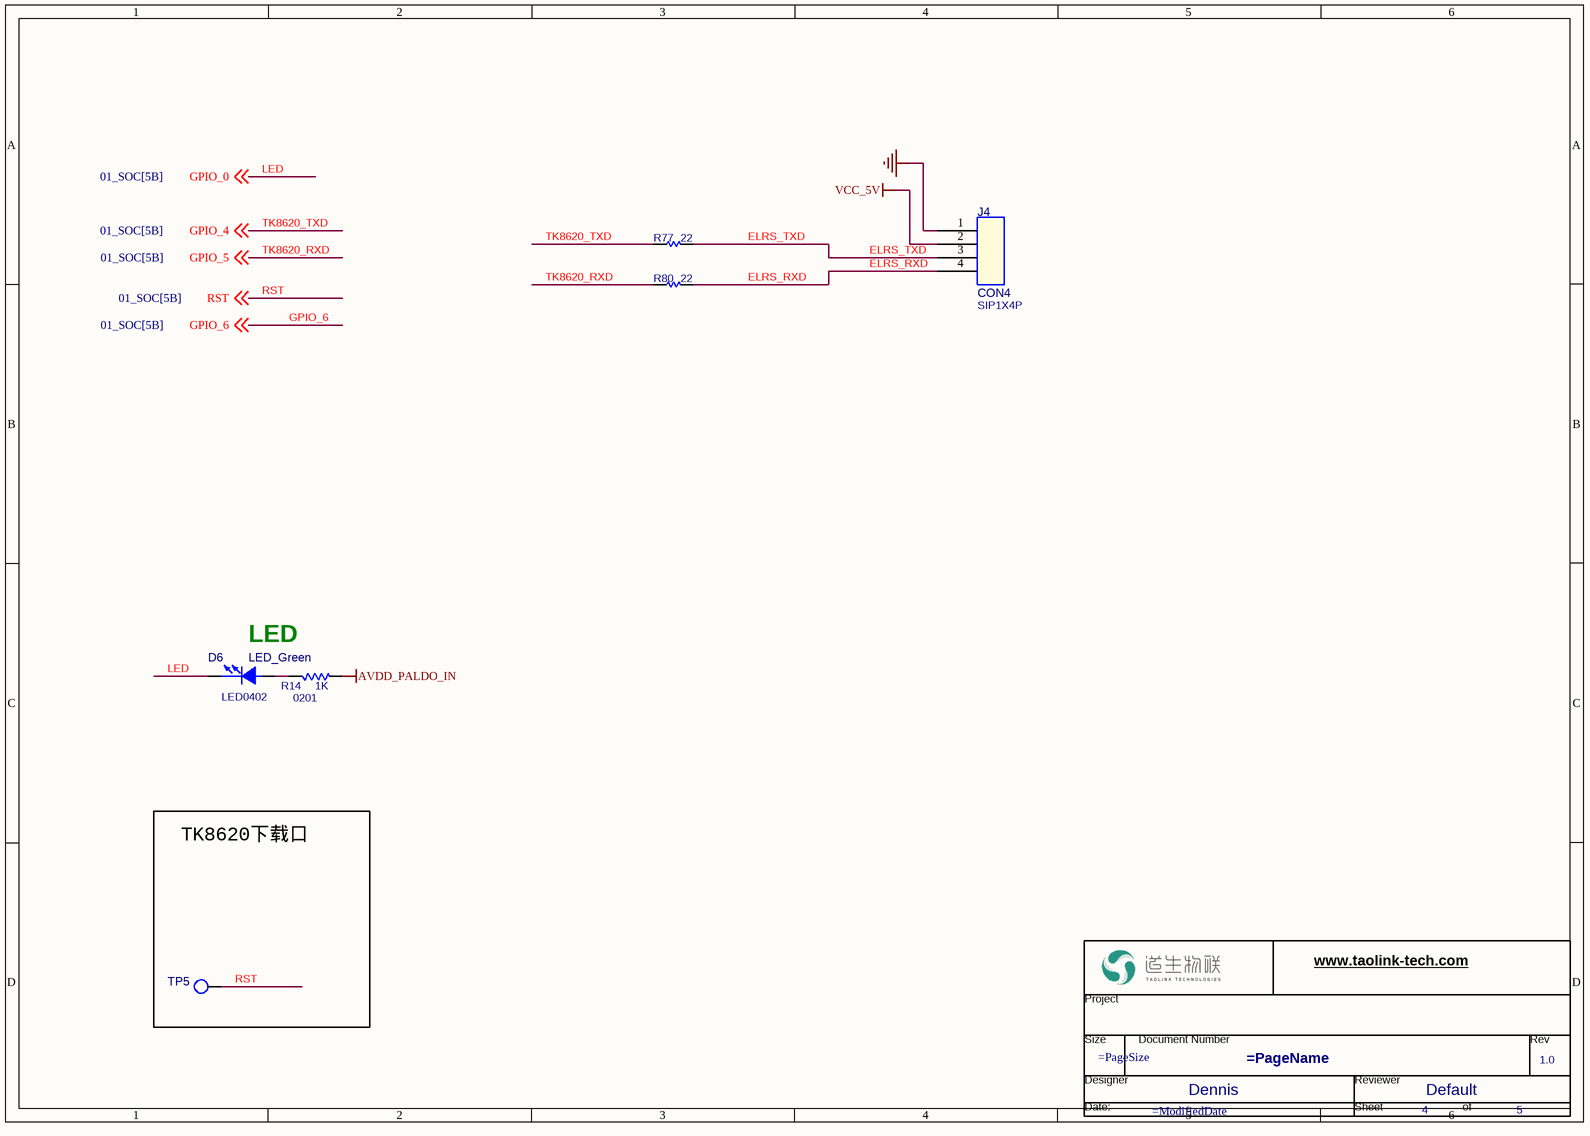
[diagram p3: 04_UART.SchDoc]

### Parts
(Parts that share a designator on the sheet are numbered #1, #2 ... from top to bottom, then left to right.)
*#4  RevCode: 1.0  Designer: Dennis  Reviewer: Default  Page Number: 4  Page Count: 5  (graphical)
D6  LED_Green  [LED0402]
J4  CON4  [SIP1X4P]
R14  1K  [0201]
R77  22  [0201]
R80  22  [0201]
TP5  NC  [TP1_6MM]  (value not drawn)

### Blocks framed on the sheet
TK8620下载口: TP5

### Nets
AVDD_PALDO_IN: R14.2  [project net VBAT_3V3]
GND: J4.1
VCC_5V: J4.2
ELRS_RXD: J4.4 R80.2
ELRS_TXD: J4.3 R77.2
GPIO_0: D6.2(CATHODE) ; off-sheet GPIO_0  [also labelled LED]
GPIO_4: R77.1 ; off-sheet GPIO_4  [also labelled TK8620_TXD]
GPIO_5: R80.1 ; off-sheet GPIO_5  [also labelled TK8620_RXD]
RST: TP5.1(TP) ; off-sheet RST
NetD6_1: D6.1(ANODE) R14.1

### Notes on the sheet
- LED
- (in symbol TaoLin_DesignName) www.taolink-tech.com; Project; Size; Document Number; Rev; Designer; Reviewer; Date:; Sheet; of

### Library data of the parts
*#4 = TaoLin_DesignName: Page Create Date: March  8, 1995; Page Size: =PageSize; Page Name: =PageName; Page Modify Date: =ModifiedDate
D6 = MFOE1101_0: Part Reference: D6; Value: LED_Green; PCB Footprint: LED0402
J4 = CON4: Part Reference: J4; Value: CON4; PCB Footprint: SIP1X4P
R14 = R_0: Part Reference: R14; Value: 1K; PCB Footprint: 0201
R77 = RES: Part Reference: R77; FPLIST: 0402R_S,0402R,0402R_M,0402R_MIN,R0402; 存货编码: 040101199; 存货名称: 贴片电阻; 规格: 贴装碳膜电阻器－110KR－±1%－1/16W－0402; 型号: 110K 1%; 存货简称: TURBO; Value: 22; PCB Footprint: 0201
R80 = RES: Part Reference: R80; 存货简称: TURBO; 型号: 110K 1%; 规格: 贴装碳膜电阻器－110KR－±1%－1/16W－0402; 存货名称: 贴片电阻; 存货编码: 040101199; FPLIST: 0402R_S,0402R,0402R_M,0402R_MIN,R0402; Value: 22; PCB Footprint: 0201
TP5 = T POINT R: Part Reference: TP5; Value: NC; PCB Footprint: TP1_6MM

## Sheet 05_Notes.SchDoc
size 246 x 182 mm; Page Create Date: March  8, 1995; Page Number: 5; Page Size: A; Reviewer: Default; Page Count: 5; Comment: TaoLin_DesignName; Designer: Dennis; Page Name: 05_Notes; RevCode: 1.0; DsnPath: H:\PCB\2026\狼王傻波一\20260204_V0_ELRS-RX\ELRS-RX-MODULE-V11\ELRS-RX-MODULE-V11-20260127.DSN; SchematicName: SCHEMATIC1; PageName: 05_Notes; PageSize: A; TopSchematic: True
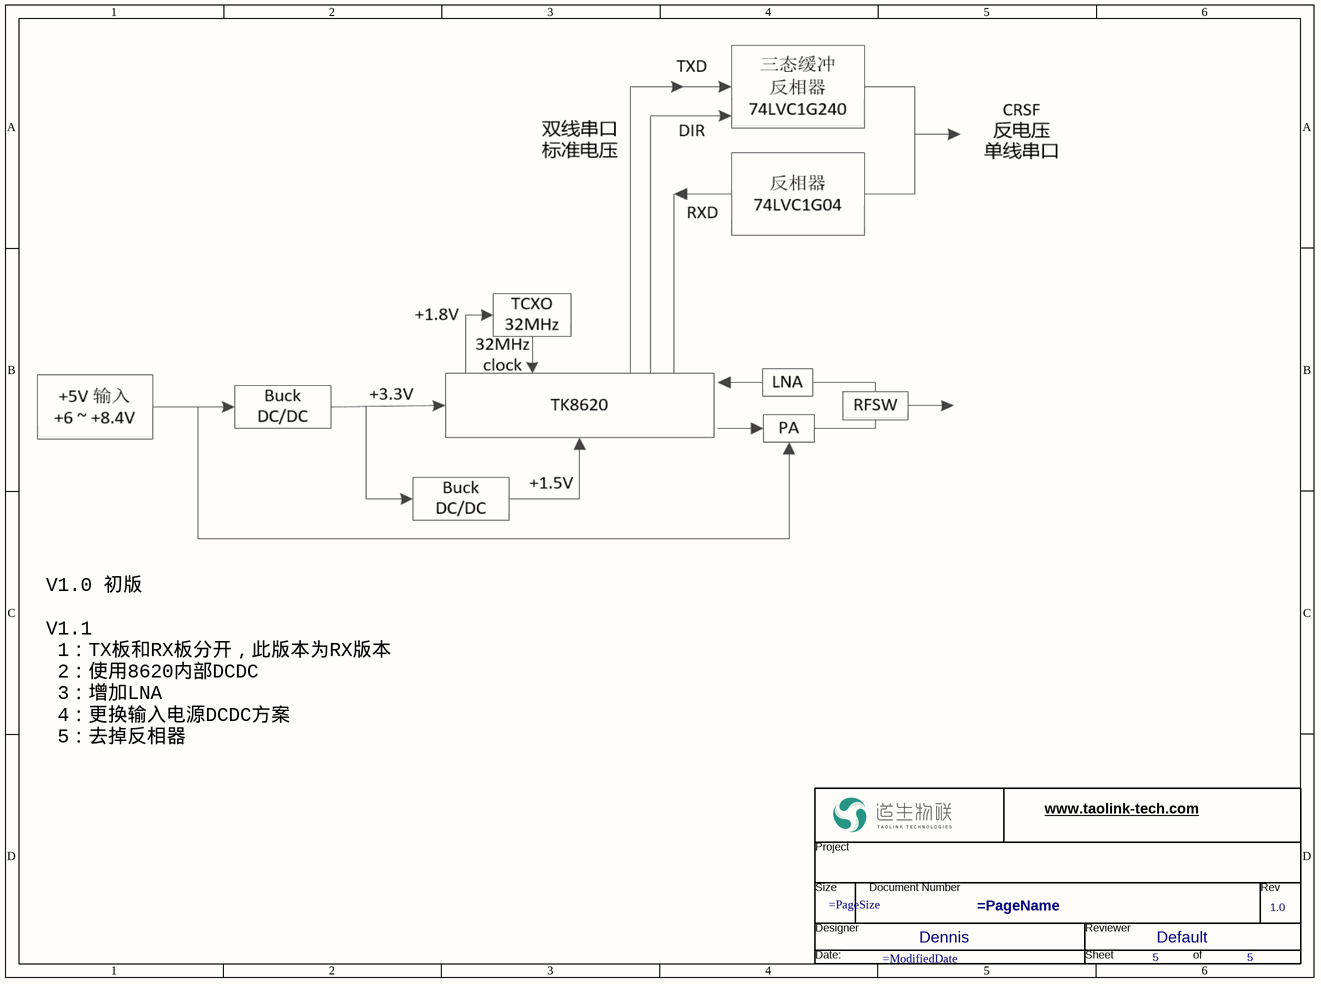
[diagram p4: 05_Notes.SchDoc]

### Parts
(Parts that share a designator on the sheet are numbered #1, #2 ... from top to bottom, then left to right.)
*#5  RevCode: 1.0  Designer: Dennis  Reviewer: Default  Page Number: 5  (hidden comment: TaoLin_DesignName)  (graphical)

### Notes on the sheet
- V1.0 初版
  V1.1
  1：TX板和RX板分开，此版本为RX版本
  2：使用8620内部DCDC
  3：增加LNA
  4：更换输入电源DCDC方案
  5：去掉反相器
- (in symbol TaoLin_DesignName) www.taolink-tech.com; Project; Size; Document Number; Rev; Designer; Reviewer; Date:; Sheet; of

### Library data of the parts
*#5 = TaoLin_DesignName: Page Create Date: March  8, 1995; Page Size: =PageSize; Page Name: =PageName; Page Count: 5; Page Modify Date: =ModifiedDate

## Nets that join several sheets
AVDD_SX_1V5: 01_SOC (U1.16), 03_Power (B4.2 C10.1)
AVDD_TX_1V5: 01_SOC (U1.25), 03_Power (B5.2 C12.1)
GND: 01_SOC (9 pins), 02_RF (14 pins), 03_Power (20 pins), 04_UART (J4.1)
PALDO1V3_OUT: 01_SOC (U1.22), 02_RF (C36.1 L2.1)
VBAT_3V3: 01_SOC (5 pins), 02_RF (5 pins), 03_Power (7 pins), 04_UART (R14.2)
VBAT_BG-3V3: 01_SOC (U1.17), 03_Power (C5.1 R20.2)
VCC_5V: 03_Power (C188.1 R85.1 U4.4 U4.5), 04_UART (J4.2)
VDD_DCIN_1V5: 01_SOC (U1.19), 03_Power (B6.2 C11.1)
VDD_IO_1V8: 01_SOC (U1.11 U1.26), 03_Power (C14.1 C193.1)
VREG_1V5_OUT: 01_SOC (U1.6), 03_Power (B7.1 C183.2 C185.1 L22.2)
BUCK_SW: 01_SOC (U1.7), 03_Power (L22.1)
GPIO_0: 01_SOC (U1.28), 04_UART (D6.2)
GPIO_1: 01_SOC (U1.29), 02_RF (C28.1 U2.4)
GPIO_2: 01_SOC (U1.30), 02_RF (C26.1 U2.6 U9.5)
GPIO_4: 01_SOC (U1.1), 04_UART (R77.1)
GPIO_5: 01_SOC (U1.2), 04_UART (R80.1)
RF_IN: 01_SOC (U1.18), 02_RF (L6.1)
RF_OUT: 01_SOC (U1.21), 02_RF (C24.1 L2.2 L3.1)
RST: 01_SOC (R11.1 U1.12), 04_UART (TP5.1)